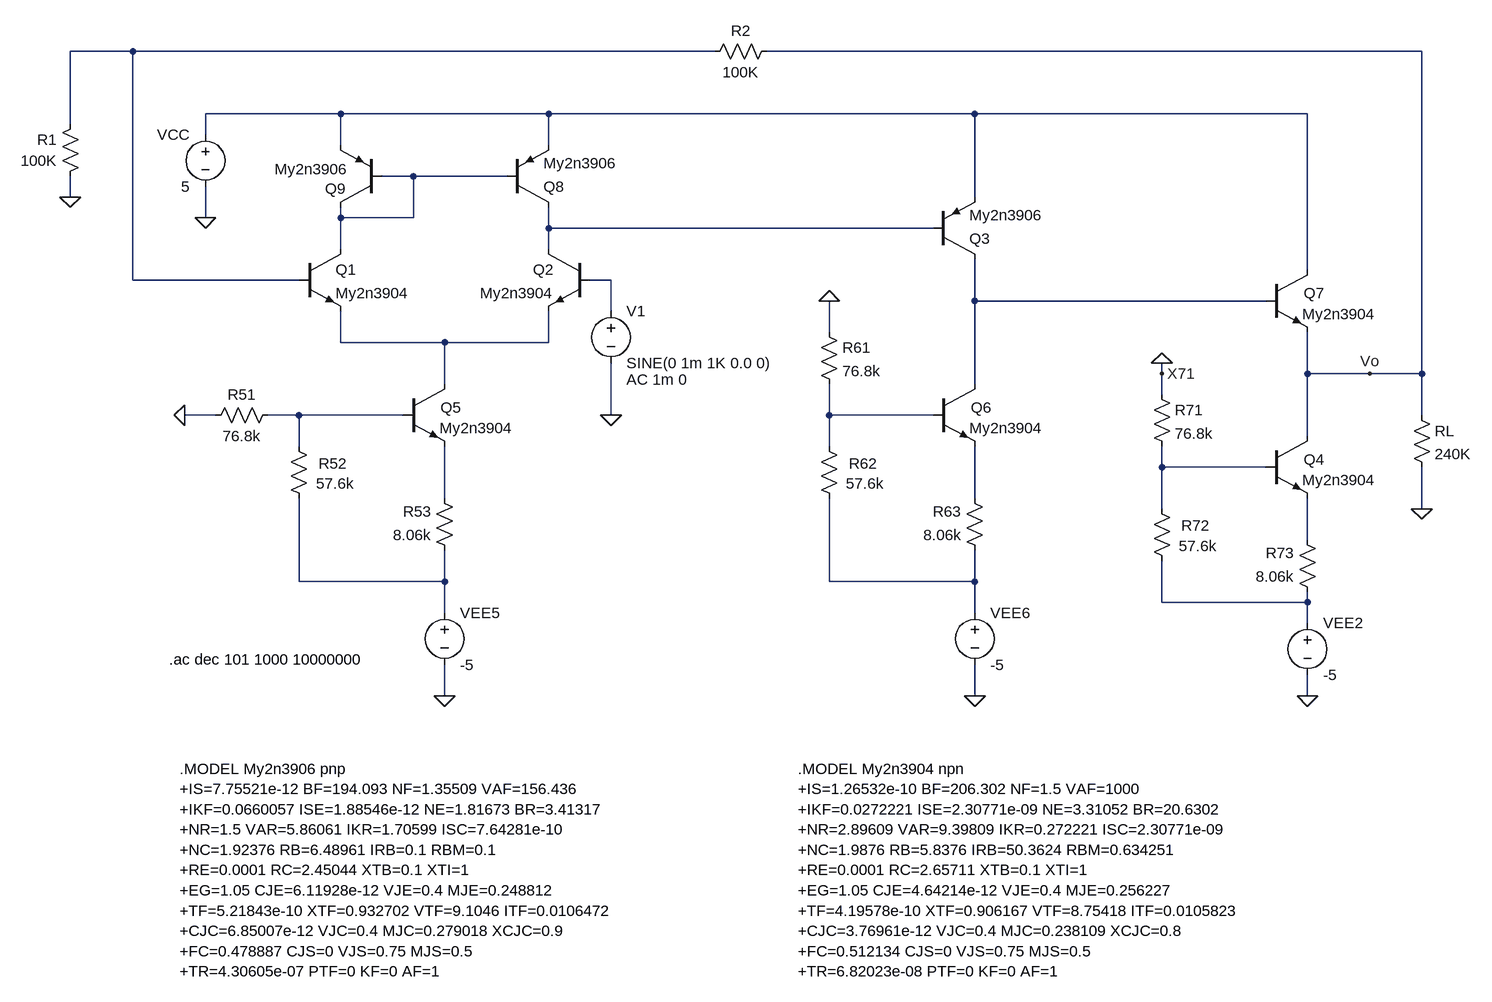
[diagram p0: schematic project4_p1b.asc]
project4_p1b.asc, the LTspice schematic file:
Version 4
SHEET 1 3060 1032
WIRE -192 -416 -288 -416
WIRE 704 -416 -192 -416
WIRE 1792 -416 784 -416
WIRE 128 -320 -80 -320
WIRE 448 -320 128 -320
WIRE 1104 -320 448 -320
WIRE 1616 -320 1104 -320
WIRE -288 -304 -288 -416
WIRE -80 -288 -80 -320
WIRE 128 -272 128 -320
WIRE 448 -272 448 -320
WIRE 240 -224 192 -224
WIRE 384 -224 240 -224
WIRE -288 -192 -288 -224
WIRE 1104 -192 1104 -320
WIRE -80 -160 -80 -208
WIRE 128 -160 128 -176
WIRE 240 -160 240 -224
WIRE 240 -160 128 -160
WIRE 448 -144 448 -176
WIRE 1040 -144 448 -144
WIRE 128 -112 128 -160
WIRE 448 -112 448 -144
WIRE 1616 -80 1616 -320
WIRE -192 -64 -192 -416
WIRE 64 -64 -192 -64
WIRE 544 -64 512 -64
WIRE 1104 -32 1104 -96
WIRE 1552 -32 1104 -32
WIRE 544 -16 544 -64
WIRE 880 16 880 -32
WIRE 128 32 128 -16
WIRE 288 32 128 32
WIRE 448 32 448 -16
WIRE 448 32 288 32
WIRE 1392 80 1392 64
WIRE 1616 80 1616 16
WIRE 1712 80 1616 80
WIRE 1792 80 1792 -416
WIRE 1792 80 1712 80
WIRE 288 96 288 32
WIRE 1104 96 1104 -32
WIRE 1392 112 1392 80
WIRE -64 144 -112 144
WIRE 64 144 16 144
WIRE 224 144 64 144
WIRE 544 144 544 64
WIRE 880 144 880 96
WIRE 1040 144 880 144
WIRE 1792 144 1792 80
WIRE 1616 176 1616 80
WIRE 64 192 64 144
WIRE 880 192 880 144
WIRE 1392 224 1392 192
WIRE 1552 224 1392 224
WIRE 288 272 288 192
WIRE 1104 272 1104 192
WIRE 1392 288 1392 224
WIRE 1792 288 1792 224
WIRE 1616 336 1616 272
WIRE 64 400 64 272
WIRE 288 400 288 352
WIRE 288 400 64 400
WIRE 880 400 880 272
WIRE 1104 400 1104 352
WIRE 1104 400 880 400
WIRE 1392 432 1392 368
WIRE 1616 432 1616 416
WIRE 1616 432 1392 432
WIRE 288 448 288 400
WIRE 1104 448 1104 400
WIRE 1616 464 1616 432
WIRE 288 576 288 528
WIRE 1104 576 1104 528
WIRE 1616 576 1616 544
FLAG -112 144 0
FLAG -80 -160 0
FLAG 288 576 0
FLAG 544 144 0
FLAG -288 -192 0
FLAG 880 -32 0
FLAG 1104 576 0
FLAG 1392 64 0
FLAG 1616 576 0
FLAG 1792 288 0
FLAG 1392 80 X71
FLAG 1712 80 Vo
SYMBOL npn 224 96 R0
WINDOW 0 58 36 Left 2
SYMATTR InstName Q5
SYMATTR Value My2n3904
SYMBOL voltage 288 432 R0
WINDOW 123 0 0 Left 0
WINDOW 39 0 0 Left 0
SYMATTR InstName VEE5
SYMATTR Value -5
SYMBOL voltage -80 -304 M0
WINDOW 123 0 0 Left 0
WINDOW 39 0 0 Left 0
SYMATTR InstName VCC
SYMATTR Value 5
SYMBOL res 304 368 R180
WINDOW 0 36 76 Left 2
WINDOW 3 36 40 Left 2
SYMATTR InstName R53
SYMATTR Value 8.06k
SYMBOL res 48 176 R0
WINDOW 0 46 42 Left 2
WINDOW 3 42 73 Left 2
SYMATTR InstName R52
SYMATTR Value 57.6k
SYMBOL res -80 160 R270
WINDOW 0 32 56 VTop 2
WINDOW 3 0 56 VBottom 2
SYMATTR InstName R51
SYMATTR Value 76.8k
SYMBOL npn 64 -112 R0
SYMATTR InstName Q1
SYMATTR Value My2n3904
SYMBOL npn 512 -112 M0
SYMATTR InstName Q2
SYMATTR Value My2n3904
SYMBOL pnp 192 -176 R180
WINDOW 0 56 29 Left 2
WINDOW 3 52 59 Left 2
SYMATTR InstName Q9
SYMATTR Value My2n3906
SYMBOL pnp 384 -176 M180
SYMATTR InstName Q8
SYMATTR Value My2n3906
SYMBOL voltage 544 -32 R0
WINDOW 123 24 121 Left 2
WINDOW 39 0 0 Left 0
SYMATTR Value2 AC 1m 0
SYMATTR InstName V1
SYMATTR Value SINE(0 1m 1K 0.0 0)
SYMBOL res -272 -320 M0
WINDOW 3 36 72 Left 2
SYMATTR Value 100K
SYMATTR InstName R1
SYMBOL npn 1040 96 R0
WINDOW 0 58 36 Left 2
SYMATTR InstName Q6
SYMATTR Value My2n3904
SYMBOL voltage 1104 432 R0
WINDOW 123 0 0 Left 0
WINDOW 39 0 0 Left 0
SYMATTR InstName VEE6
SYMATTR Value -5
SYMBOL res 1120 368 R180
WINDOW 0 36 76 Left 2
WINDOW 3 36 40 Left 2
SYMATTR InstName R63
SYMATTR Value 8.06k
SYMBOL res 864 176 R0
WINDOW 0 46 42 Left 2
WINDOW 3 42 73 Left 2
SYMATTR InstName R62
SYMATTR Value 57.6k
SYMBOL res 864 0 R0
SYMATTR InstName R61
SYMATTR Value 76.8k
SYMBOL npn 1552 176 R0
WINDOW 0 58 36 Left 2
SYMATTR InstName Q4
SYMATTR Value My2n3904
SYMBOL voltage 1616 448 R0
WINDOW 123 0 0 Left 0
WINDOW 39 0 0 Left 0
SYMATTR InstName VEE2
SYMATTR Value -5
SYMBOL res 1632 432 R180
WINDOW 0 36 76 Left 2
WINDOW 3 36 40 Left 2
SYMATTR InstName R73
SYMATTR Value 8.06k
SYMBOL res 1376 272 R0
WINDOW 0 46 42 Left 2
WINDOW 3 42 73 Left 2
SYMATTR InstName R72
SYMATTR Value 57.6k
SYMBOL res 1376 96 R0
SYMATTR InstName R71
SYMATTR Value 76.8k
SYMBOL pnp 1040 -96 M180
SYMATTR InstName Q3
SYMATTR Value My2n3906
SYMBOL npn 1552 -80 R0
WINDOW 0 58 36 Left 2
SYMATTR InstName Q7
SYMATTR Value My2n3904
SYMBOL res 1776 128 R0
SYMATTR InstName RL
SYMATTR Value 240K
SYMBOL res 800 -432 R90
WINDOW 0 0 56 VBottom 2
WINDOW 3 32 56 VTop 2
SYMATTR InstName R2
SYMATTR Value 100K
TEXT 832 688 Left 2 !.MODEL My2n3904 npn\n+IS=1.26532e-10 BF=206.302 NF=1.5 VAF=1000\n+IKF=0.0272221 ISE=2.30771e-09 NE=3.31052 BR=20.6302\n+NR=2.89609 VAR=9.39809 IKR=0.272221 ISC=2.30771e-09\n+NC=1.9876 RB=5.8376 IRB=50.3624 RBM=0.634251\n+RE=0.0001 RC=2.65711 XTB=0.1 XTI=1\n+EG=1.05 CJE=4.64214e-12 VJE=0.4 MJE=0.256227\n+TF=4.19578e-10 XTF=0.906167 VTF=8.75418 ITF=0.0105823\n+CJC=3.76961e-12 VJC=0.4 MJC=0.238109 XCJC=0.8\n+FC=0.512134 CJS=0 VJS=0.75 MJS=0.5\n+TR=6.82023e-08 PTF=0 KF=0 AF=1
TEXT -120 688 Left 2 !.MODEL My2n3906 pnp\n+IS=7.75521e-12 BF=194.093 NF=1.35509 VAF=156.436\n+IKF=0.0660057 ISE=1.88546e-12 NE=1.81673 BR=3.41317\n+NR=1.5 VAR=5.86061 IKR=1.70599 ISC=7.64281e-10\n+NC=1.92376 RB=6.48961 IRB=0.1 RBM=0.1\n+RE=0.0001 RC=2.45044 XTB=0.1 XTI=1\n+EG=1.05 CJE=6.11928e-12 VJE=0.4 MJE=0.248812\n+TF=5.21843e-10 XTF=0.932702 VTF=9.1046 ITF=0.0106472\n+CJC=6.85007e-12 VJC=0.4 MJC=0.279018 XCJC=0.9\n+FC=0.478887 CJS=0 VJS=0.75 MJS=0.5\n+TR=4.30605e-07 PTF=0 KF=0 AF=1
TEXT -136 520 Left 2 !.ac dec 101 1000 10000000

The netlist it stands for:
* project4_p1b.asc
Q5 N007 N008 N011 0 My2n3904
VEE5 N014 0 -5
VCC N002 0 5
R53 N014 N011 8.06k
R52 N008 N014 57.6k
R51 0 N008 76.8k
Q1 N003 N001 N007 0 My2n3904
Q2 N004 N005 N007 0 My2n3904
Q9 N003 N003 N002 0 My2n3906
Q8 N004 N003 N002 0 My2n3906
V1 N005 0 SINE(0 1m 1K 0.0 0) AC 1m 0
R1 N001 0 100K
Q6 N006 N009 N012 0 My2n3904
VEE6 N015 0 -5
R63 N015 N012 8.06k
R62 N009 N015 57.6k
R61 0 N009 76.8k
Q4 Vo N010 N013 0 My2n3904
VEE2 N016 0 -5
R73 N016 N013 8.06k
R72 N010 N016 57.6k
R71 0 N010 76.8k
Q3 N006 N004 N002 0 My2n3906
Q7 N002 N006 Vo 0 My2n3904
RL Vo 0 240K
R2 Vo N001 100K
.model NPN NPN
.model PNP PNP
.lib standard.bjt
.MODEL My2n3904 npn
+IS=1.26532e-10 BF=206.302 NF=1.5 VAF=1000
+IKF=0.0272221 ISE=2.30771e-09 NE=3.31052 BR=20.6302
+NR=2.89609 VAR=9.39809 IKR=0.272221 ISC=2.30771e-09
+NC=1.9876 RB=5.8376 IRB=50.3624 RBM=0.634251
+RE=0.0001 RC=2.65711 XTB=0.1 XTI=1
+EG=1.05 CJE=4.64214e-12 VJE=0.4 MJE=0.256227
+TF=4.19578e-10 XTF=0.906167 VTF=8.75418 ITF=0.0105823
+CJC=3.76961e-12 VJC=0.4 MJC=0.238109 XCJC=0.8
+FC=0.512134 CJS=0 VJS=0.75 MJS=0.5
+TR=6.82023e-08 PTF=0 KF=0 AF=1
.MODEL My2n3906 pnp
+IS=7.75521e-12 BF=194.093 NF=1.35509 VAF=156.436
+IKF=0.0660057 ISE=1.88546e-12 NE=1.81673 BR=3.41317
+NR=1.5 VAR=5.86061 IKR=1.70599 ISC=7.64281e-10
+NC=1.92376 RB=6.48961 IRB=0.1 RBM=0.1
+RE=0.0001 RC=2.45044 XTB=0.1 XTI=1
+EG=1.05 CJE=6.11928e-12 VJE=0.4 MJE=0.248812
+TF=5.21843e-10 XTF=0.932702 VTF=9.1046 ITF=0.0106472
+CJC=6.85007e-12 VJC=0.4 MJC=0.279018 XCJC=0.9
+FC=0.478887 CJS=0 VJS=0.75 MJS=0.5
+TR=4.30605e-07 PTF=0 KF=0 AF=1
.ac dec 101 1000 10000000
.backanno
.end